# EAGLE design Boost Kit (EAGLE 7.7.0)
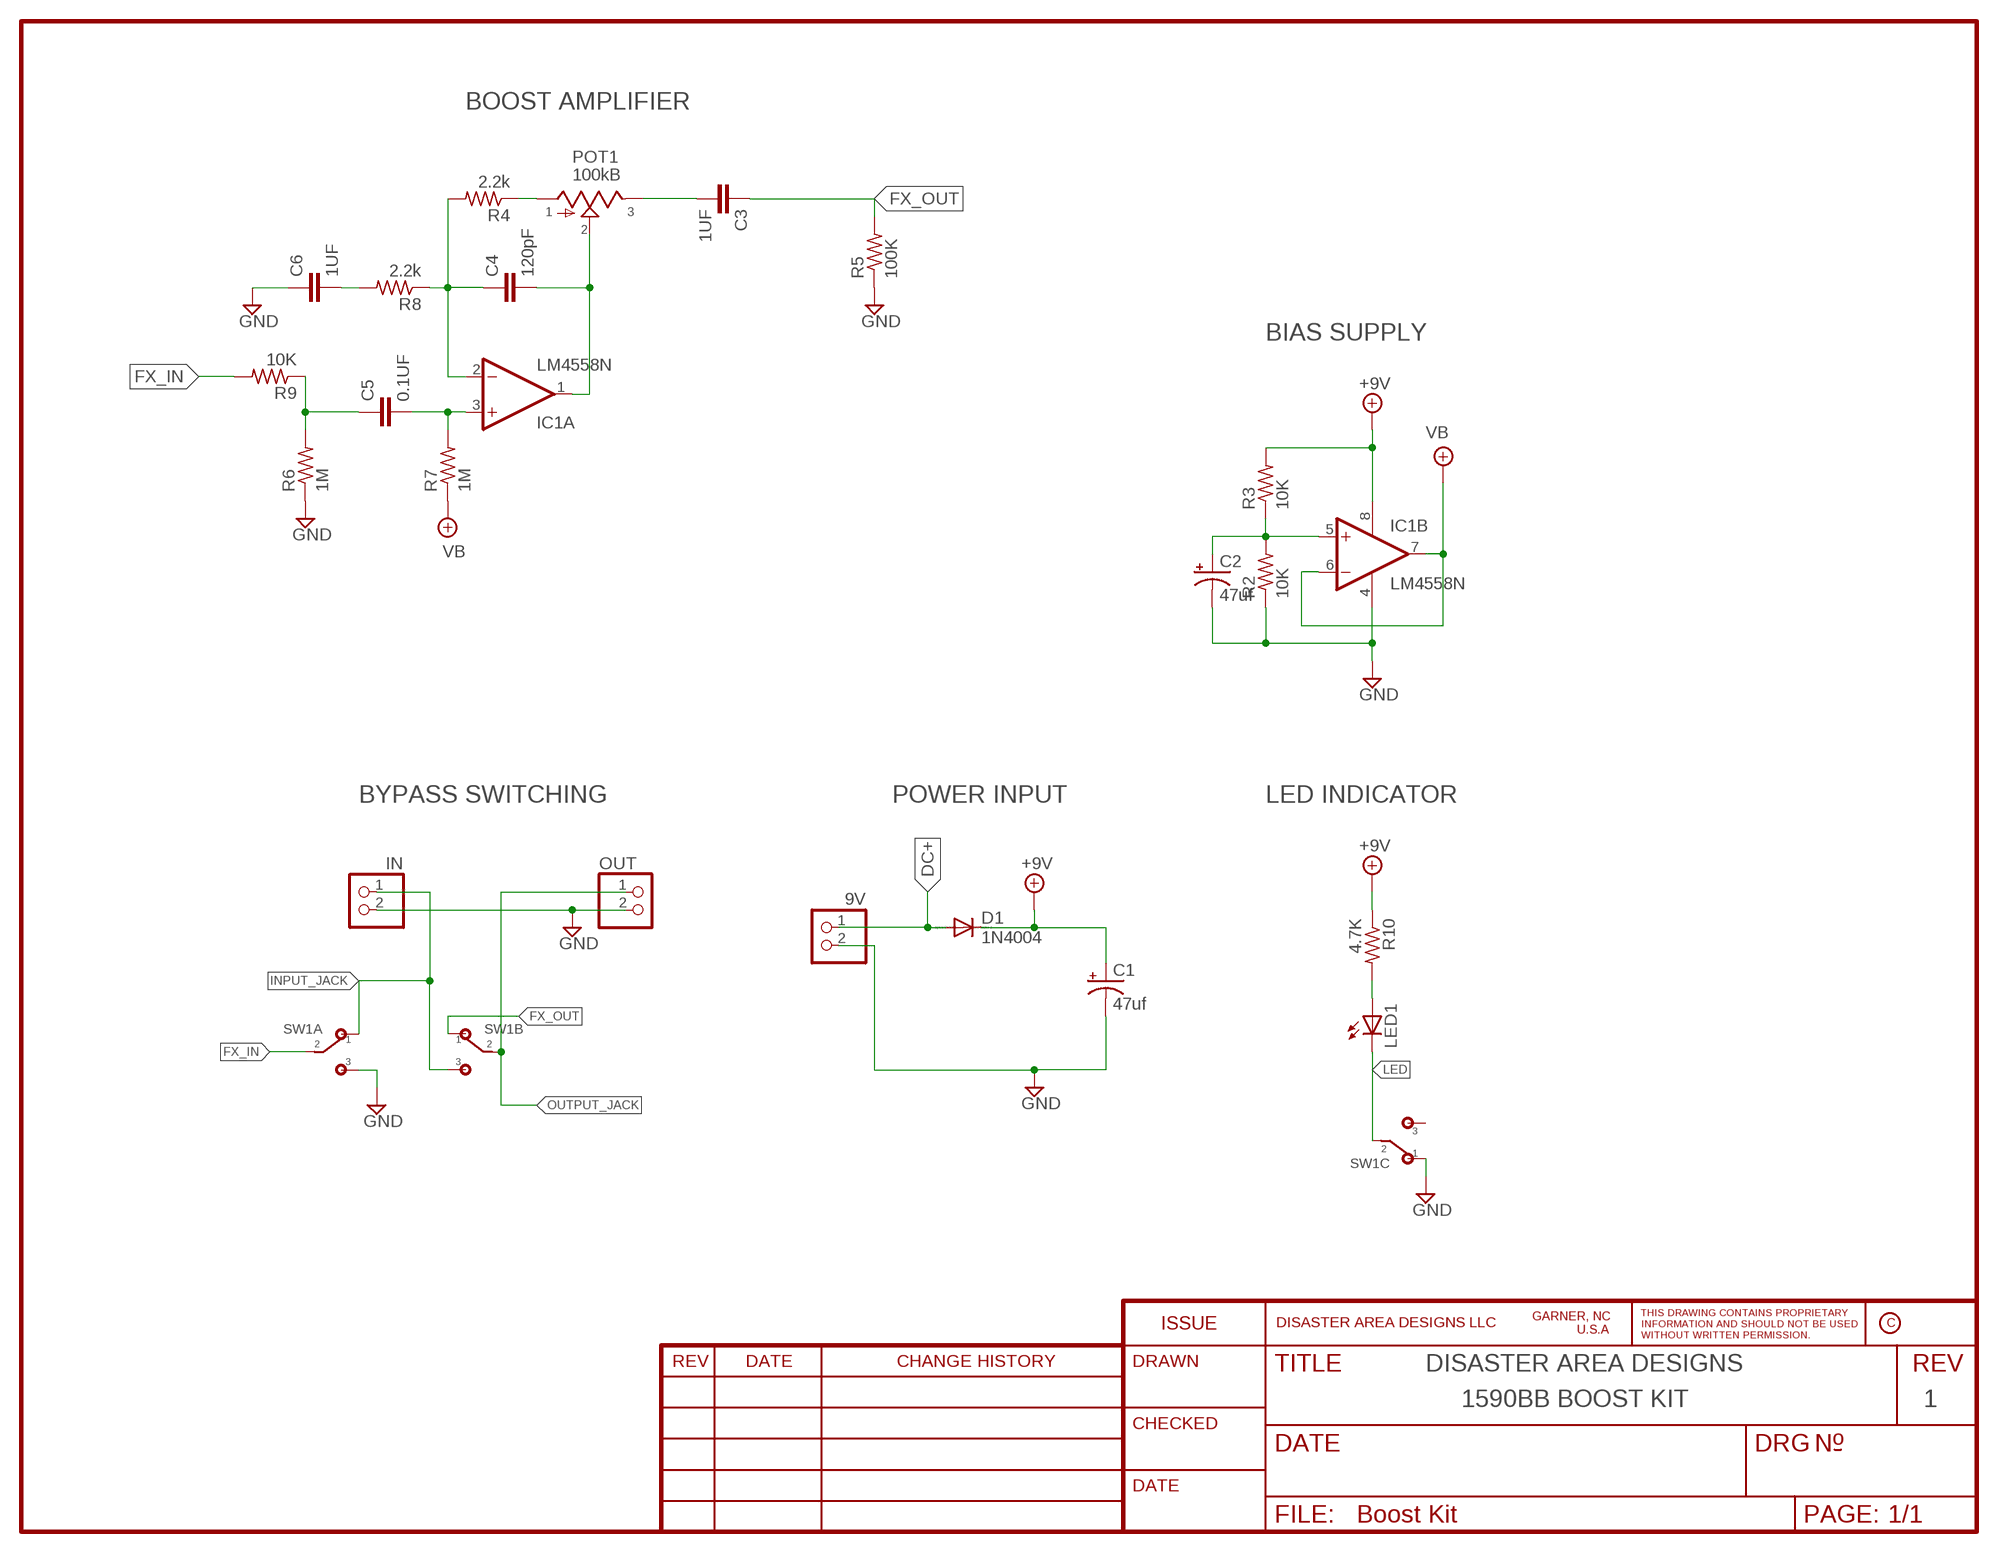
[diagram p0: schematic, sheet 1]

## Parts
9V  PINHD-1X2  [1X02]
C1  47uf  CPOL-USE2.5-6  [E2,5-6]
C2  47uf  CPOL-USE2.5-6  [E2,5-6]
C3  1UF  072X0352  [072X035]
C4  120pF  072X0352  [072X035]
C5  0.1UF  072X0352  [072X035]
C6  1UF  072X0352  [072X035]
D1  1N4004  [DO41-10]
IC1  LM4558N  [DIL08]
IN  PINHD-1X2  [1X02]
LED1  LED5MM  [LED5MM]
OUT  PINHD-1X2  [1X02]
POT1  100kB  POT16MM  [16MM]
R2  10K  6MM.4  [R0207/4]
R3  10K  6MM.4  [R0207/4]
R4  2.2k  6MM.4  [R0207/4]
R5  100K  6MM.4  [R0207/4]
R6  1M  6MM.4  [R0207/4]
R7  1M  6MM.4  [R0207/4]
R8  2.2k  6MM.4  [R0207/4]
R9  10K  6MM.4  [R0207/4]
R10  4.7K  6MM.4  [R0207/4]
SW1  3PDT  [3PDT]

## Nets
+9V: C1.+ D1.C IC1.8(P:V+) R3.2 R10.1
DC+: 9V.1 D1.A
FX_IN: R9.2 SW1.A2
FX_IN2: C5.1 R6.2 R9.1
FX_OUT: C3.1 R5.2 SW1.B1
GND: 9V.2 C1.- C2.- C6.1 IC1.4(P:V-) IN.2 OUT.2 R2.1 R5.1 R6.1 SW1.A3 SW1.C1
INPUT_JACK: IN.1 SW1.A1 SW1.B3
LED: LED1.K(C) SW1.C2
N$1: LED1.A R10.2
N$2: C4.2 IC1.1(A:OUT) POT1.2
N$3: C4.1 IC1.2(A:-IN) R4.2 R8.1
N$4: C6.2 R8.2
N$5: POT1.1 R4.1
N$6: C2.+ IC1.5(B:+IN) R2.2 R3.1
N$11: C3.2 POT1.3
N$12: C5.2 IC1.3(A:+IN) R7.2
OUTPUT_JACK: OUT.1 SW1.B2
VB: IC1.6(B:-IN) IC1.7(B:OUT) R7.1
Unconnected: SW1.C3

## Notes on the sheet
- BOOST AMPLIFIER
- BIAS SUPPLY
- BYPASS SWITCHING | POWER INPUT | LED INDICATOR
- DISASTER AREA DESIGNS
- 1590BB BOOST KIT | 1

## Library data of the parts
9V IN OUT = pinhead:PINHD-1X2: PIN HEADER
C1 C2 = rcl:CPOL-US: POLARIZED CAPACITOR, American symbol
C3-C6 = mb_caps-box:072X035: 0.15 - 1.0uF; WIMA MKP2 63, 100V: 0.047uF; MKS2 50V: 0.68 - 1.0uF; 63V: 0.33 - 0.47uF; 100V: 0.15 - 0.22uF;
D1 = diode:1N4004: DIODE general purpose rectifier, 1 A
IC1 = mb_ics:*4558: *4558 Op Amp Infamous for its use in tube screamers. This op amp has many manufacturers, hence the leading "*" in the name. The JRC4558 is a widely used example.
LED1 = led:LED: LED OSRAM: - CHIPLED LG R971, LG N971, LY N971, LG Q971, LY Q971, LO R971, LY R971 LH N974, LH R974 LS Q976, LO Q976, LY Q976 LO Q996 - Hyper CHIPLED LW Q18S LB Q993, LB Q99A, LB R99A - SideLED LS A670, LO A670, LY A670, LG A670, LP A670 LB A673, LV A673, LT A673, LW A673 LH A674 LY A675 LS A676, LA A676, LO A676, LY A676, LW A676 LS A679, LY A679, LG A679 - Hyper Micro SIDELED® LS Y876, LA Y876, LO Y876, LY Y876 LT Y87S - SmartLED LW L88C, LW L88S LB L89C, LB L89S, LG L890 LS L89K, LO L89K, LY L89K LS L896, LA L896, LO L896, LY L896 - TOPLED LS T670, LO T670, LY T670, LG T670, LP T670 LSG T670, LSP T670, LSY T670, LOP T670, LYG T670 LG T671, LOG T671, LSG T671 LB T673, LV T673, LT T673, LW T673 LH T674 LS T676, LA T676, LO T676, LY T676, LB T676, LH T676, LSB T676, LW T676 LB T67C, LV T67C, LT T67C, LS T67K, LO T67K, LY T67K, LW E67C LS E67B, LA E67B, LO E67B, LY E67B, LB E67C, LV E67C, LT E67C LW T67C LS T679, LY T679, LG T679 LS T770, LO T770, LY T770, LG T770, LP T770 LB T773, LV T773, LT T773, LW T773 LH T774 LS E675, LA E675, LY E675, LS T675 LS T776, LA T776, LO T776, LY T776, LB T776 LHGB T686 LT T68C, LB T68C - Hyper Mini TOPLED® LB M676 - Mini TOPLED Santana® LG M470 LS M47K, LO M47K, LY M47K Source: http://www.osram.convergy.de LUXEON: - LUMILED® LXK2-PW12-R00, LXK2-PW12-S00, LXK2-PW14-U00, LXK2-PW14-V00 LXK2-PM12-R00, LXK2-PM12-S00, LXK2-PM14-U00 LXK2-PE12-Q00, LXK2-PE12-R00, LXK2-PE12-S00, LXK2-PE14-T00, LXK2-PE14-U00 LXK2-PB12-K00, LXK2-PB12-L00, LXK2-PB12-M00, LXK2-PB14-N00, LXK2-PB14-P00, LXK2-PB14-Q00 LXK2-PR12-L00, LXK2-PR12-M00, LXK2-PR14-Q00, LXK2-PR14-R00 LXK2-PD12-Q00, LXK2-PD12-R00, LXK2-PD12-S00 LXK2-PH12-R00, LXK2-PH12-S00 LXK2-PL12-P00, LXK2-PL12-Q00, LXK2-PL12-R00 Source: www.luxeon.com KINGBRIGHT: KA-3528ASYC Source: www.kingbright.com
POT1 = mb_pots:POT: Potentiometers the arrow indicates the clockwise motion of th wiper (lug 2) fully counter clockwise there is no resistance between lugs 1 and 2 fully clockwise the resistance between lugs 1 and 2 is the value of the pot
R2-R10 = mb_resistors:6MM: 6mm Resistors Leads spaced 1-6 holes apart for 0.1" perfboard. Suitable for 1/4 watt resistors.
SW1 = mb_3pdt:3PDT

## Net classes
0 default: width 0.305 mm, drill 0.584 mm, clearance 0.203 mm

## Board
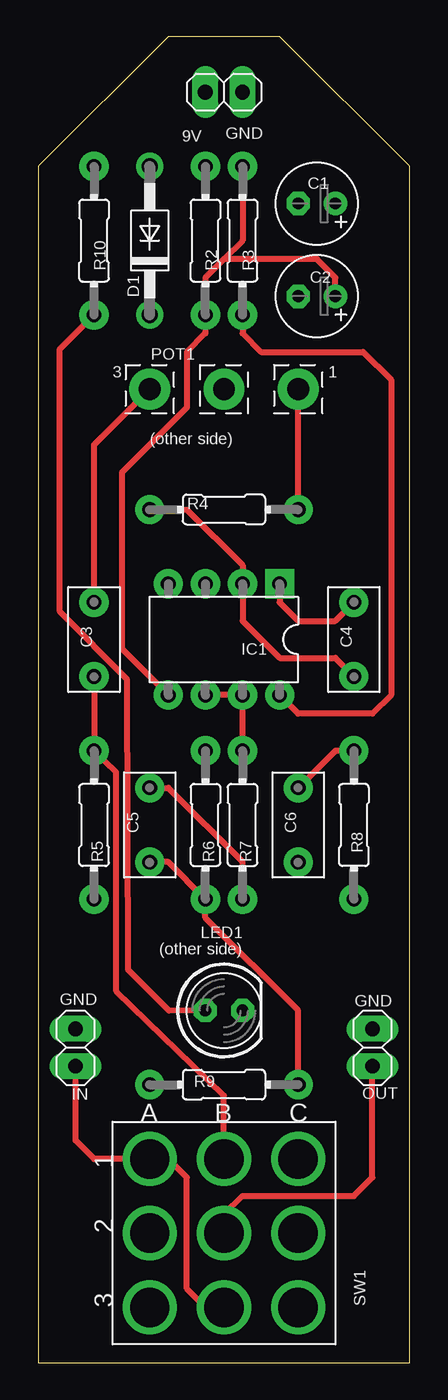
[diagram p1: board, top side]
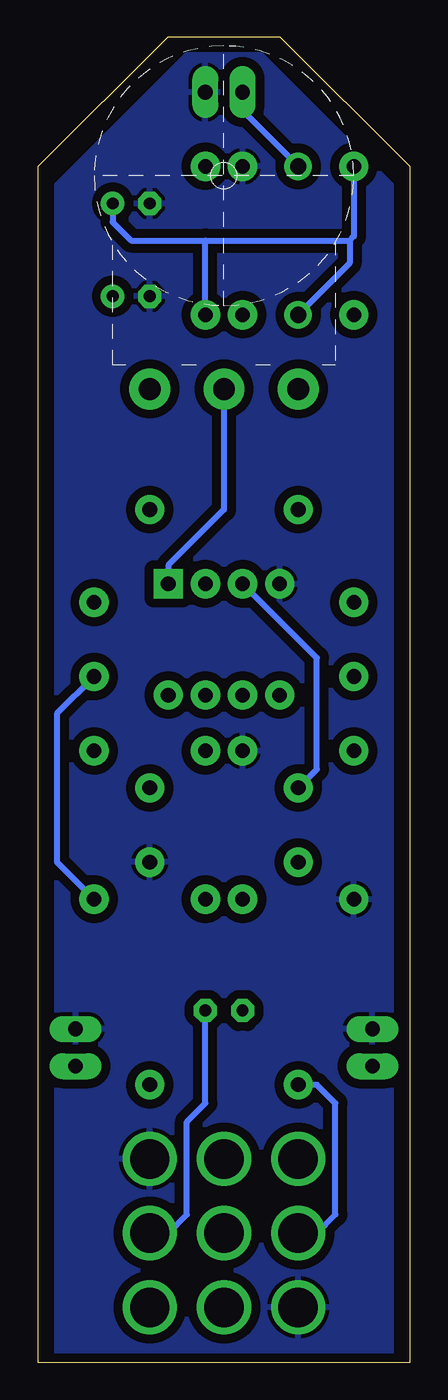
[diagram p2: board, bottom side, seen from below]

Size 25.4 x 90.81 mm. Coordinates in mm from the lower left corner, seen from the top.
Outline: 0,0 25.4,0 25.4,81.92 16.51,90.81 8.89,90.81 0,81.92 0,0
Copper layers (1*16): Top 0.0356mm / dielectric 1.5011mm / Bottom 0.0356mm
Design rules "SilverCircuits *": minimum track width 7mil, minimum drill 14mil, track to track 7mil, track to pad 7mil, pad to pad 7mil, via to via 7mil, smd to smd 0mil, copper to edge 20mil, drill to drill 8mil, minimum pad ring 15mil, minimum via ring 8mil, stop-mask expansion 4mil, vias tented up to drill 0mil, thermal gap 10mil

### Footprints (pad centres in the part's own frame; a part is rotated, then mirrored left to right if it is on the bottom)
1X02 = drill 1.016 long: 1 -1.27,0; 2 1.27,0
E2,5-6 = drill 0.813 pad 1.6: + -1.27,0 | drill 0.813 pad 1.6 octagon: - 1.27,0
072X035 = drill 1 pad 2: 1 -2.54,0; 2 2.54,0
DO41-10 = drill 1.118: A 5.08,0; C -5.08,0
DIL08 = drill 1 pad 2 square: 1 -3.81,-3.81 | drill 1 pad 2: 2 -1.27,-3.81; 3 1.27,-3.81; 4 3.81,-3.81; 5 3.81,3.81; 6 1.27,3.81; 7 -1.27,3.81; 8 -3.81,3.81
LED5MM = drill 0.813 octagon: A -1.27,0; K 1.27,0
16MM = drill 1.5 pad 2.794: 1 5.08,0; 2 0,0; 3 -5.08,0
R0207/4 = drill 1 pad 2: 1 -5.08,0; 2 5.08,0
3PDT = drill 2.7 pad 1.93: A1 -5.08,5.08; A2 -5.08,0; A3 -5.08,-5.08; B1 0,5.08; B2 0,0; B3 0,-5.08; C1 5.08,5.08; C2 5.08,0; C3 5.08,-5.08

### Placement (x,y rotation side)
9V  12.7,87 0 top
C1  19.05,79.38 180 top
C2  19.05,73.03 180 top
C3  3.81,49.53 90 top
C4  21.59,49.53 90 top
C5  7.62,36.83 90 top
C6  17.78,36.83 90 top
D1  7.62,76.83 90 top
IC1  12.7,49.53 180 top
IN  2.54,21.59 90 top
LED1  12.7,24.13 0 top
OUT  22.86,21.59 90 top
POT1  12.7,66.67 0 top
R2  11.43,76.83 270 top
R3  13.97,76.83 270 top
R4  12.7,58.42 180 top
R5  3.81,36.83 90 top
R6  11.43,36.83 270 top
R7  13.97,36.83 270 top
R8  21.59,36.83 90 top
R9  12.7,19.05 180 top
R10  3.81,76.83 270 top
SW1  12.7,8.89 0 top

### Tracks (layer width: path | path; a pad name or v marks a point on that pad's centre or on a via)
+9V
  Top 0.406: R3.2 13.97,70.48 15.24,69.22 22.23,69.22 24.13,67.31 24.13,45.72 22.86,44.45 17.78,44.45 IC1.8
  Bottom 0.406: 4.1,76.83 4.1,75.28 D1.C | C1.+ 20.32,78.11 19.05,76.83 13.97,76.83 | 13.97,76.83 4.1,76.83 | R3.2 13.97,76.83 | R10.1 3.81,77.12 4.1,76.83
DC+
  Bottom 0.406: 9V.1 11.43,85.72 D1.A
FX_IN
  Bottom 0.406: SW1.A2 6.35,8.89 5.08,10.16 5.08,17.78 6.35,19.05 R9.2
FX_IN2
  Top 0.406: C5.1 8.89,34.29 R6.2 11.43,30.48 17.78,24.13 R9.1
FX_OUT
  Top 0.406: C3.1 R5.2 5.31,40.44 5.34,25.45 12.7,18.32 SW1.B1
GND
  pour Bottom (isolate 0.61): 1.27,0 1.27,80.64 10.16,89.53 15.24,89.53 24.13,80.64 24.13,0
INPUT_JACK
  Top 0.406: SW1.B3 11.43,3.81 10.16,5.08 10.16,12.7 8.89,13.97 SW1.A1 3.81,13.97 2.54,15.24 IN.1
LED
  Bottom 0.406: SW1.C2 16.51,8.89 15.24,10.16 15.24,16.51 13.97,17.78 LED1.K
N$1
  Top 0.406: LED1.A 8.95,24.11 6.14,26.92 6.08,46.79 1.46,51.44 1.46,69.41 R10.2
N$2
  Top 0.406: IC1.1 16.51,52.07 17.78,50.8 20.32,50.8 C4.2
  Bottom 0.406: POT1.2 12.7,58.42 16.51,54.61 IC1.1
N$3
  Top 0.406: C4.1 20.32,48.26 16.51,48.26 13.97,50.8 IC1.2 13.97,54.61 10.16,58.42 R4.2
  Bottom 0.406: C4.1 24.13,44.45 24.13,34.29 R8.1
N$4
  Top 0.406: R8.2 20.32,41.91 C6.2
N$5
  Top 0.406: R4.1 POT1.1
N$6
  Top 0.406: C2.+ 20.32,74.3 19.05,75.56 12.7,75.56 | 12.7,75.56 11.43,74.3 R2.2 11.43,70.48 10.16,69.22 10.16,65.41 5.71,60.96 5.71,48.9 IC1.5 | R3.1 13.97,76.83 12.7,75.56
N$11
  Top 0.406: C3.2 3.81,62.87 POT1.3
N$12
  Top 0.406: R7.2 13.97,34.29 8.89,39.37 C5.2
  Bottom 0.406: C5.2 6.35,40.64 6.35,48.26 IC1.3
OUTPUT_JACK
  Top 0.406: SW1.B2 12.7,10.16 13.97,11.43 21.59,11.43 22.86,12.7 OUT.1
VB
  Top 0.406: R7.1 IC1.7 IC1.6

### Text on the board
tPlace: GND | (other side) | (other side) | GND | GND
Measures: SN | TEST